# EAGLE design SparkyJr_v4FTDI (EAGLE 5.10)
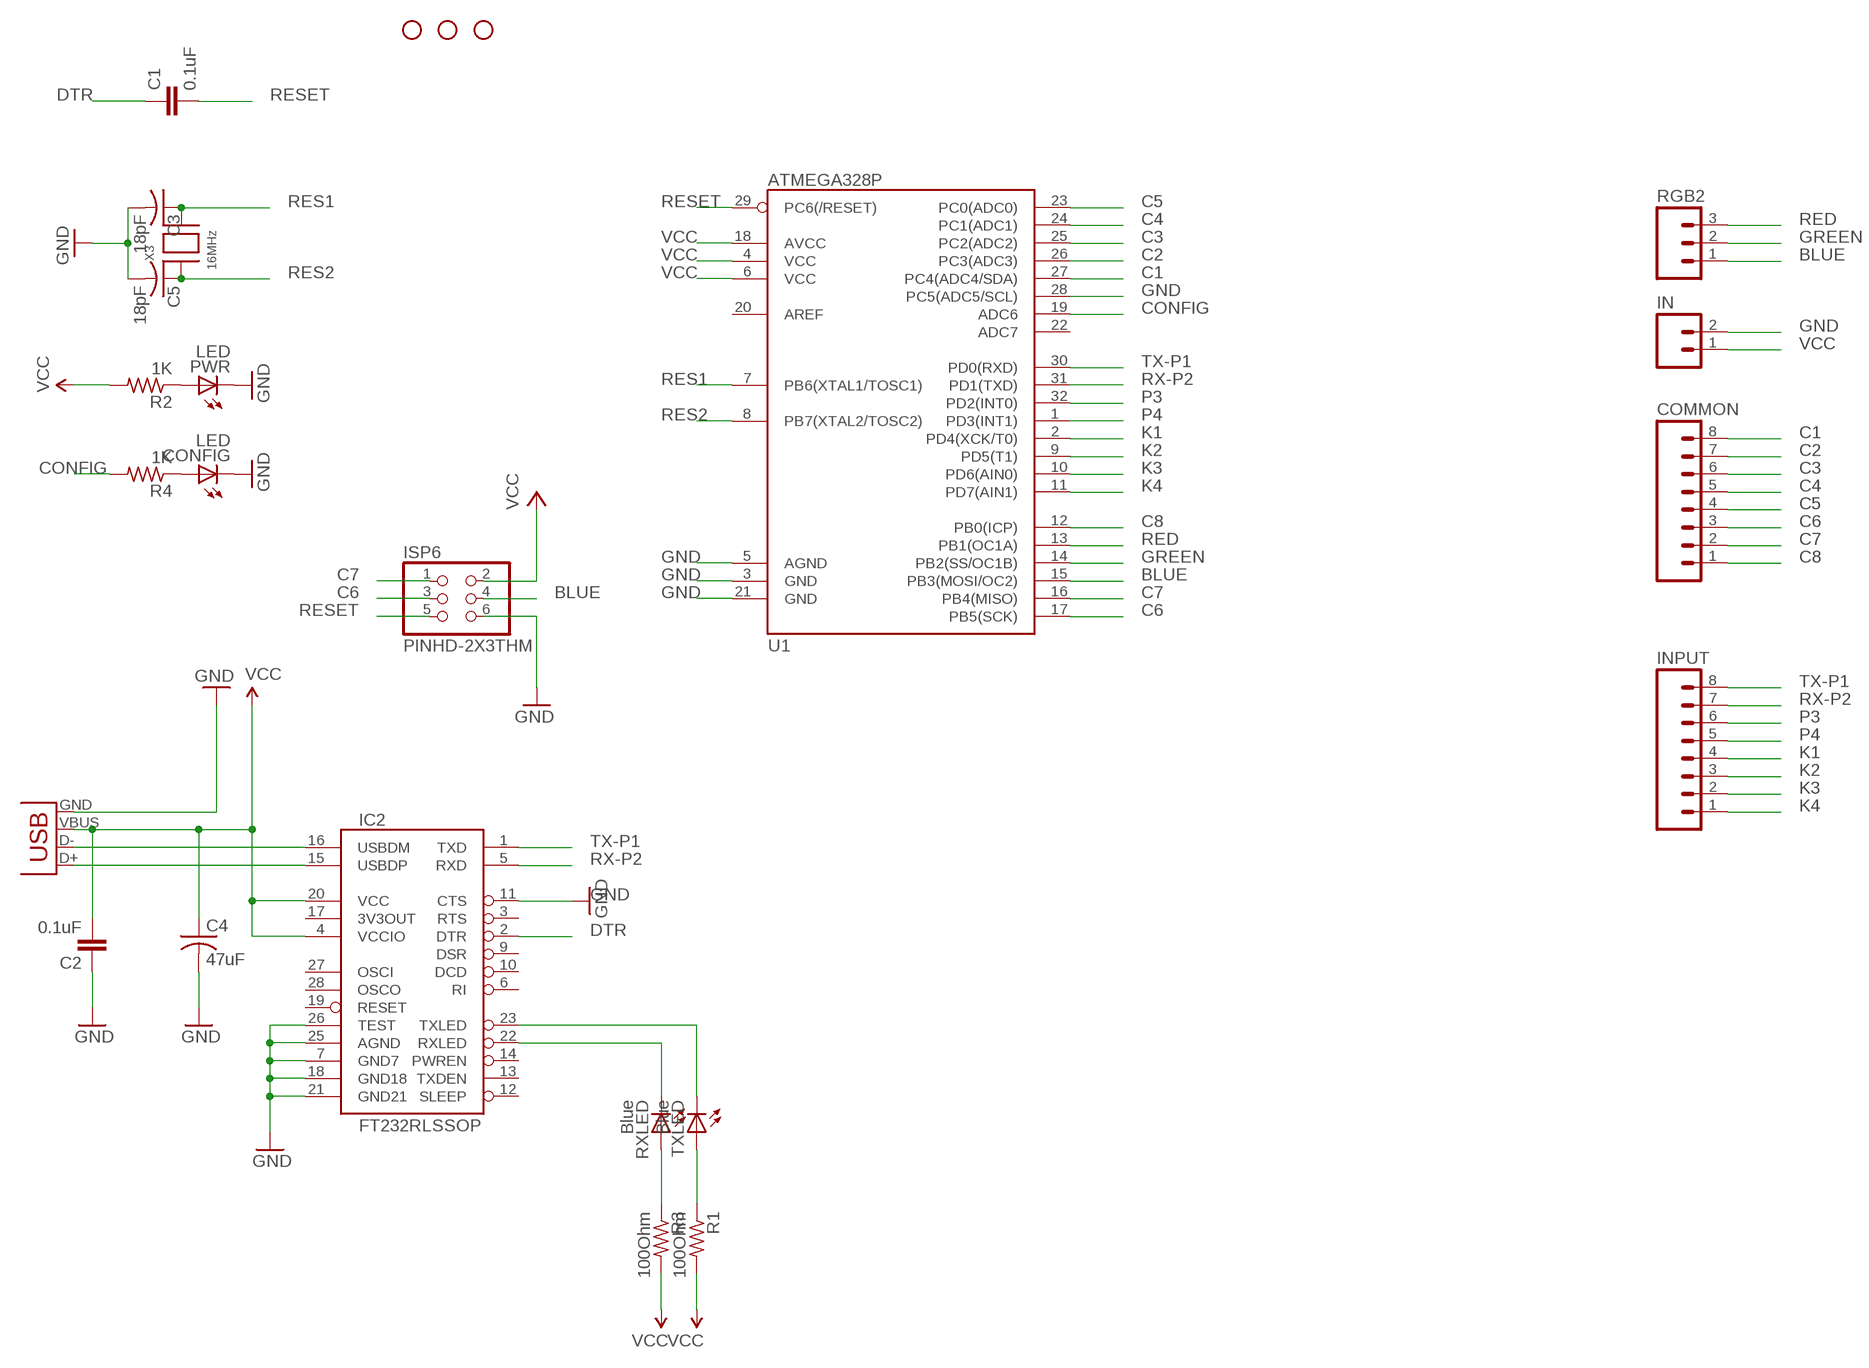
[diagram p0: schematic, sheet 1]

## Parts
C1  0.1uF  CAP0805  [0805]
C2  0.1uF  CAP0805  [0805]
C3  18pF  C-USC0805K  [C0805K]
C4  47uF  C-USC0805  [C0805]
C5  18pF  C-USC0805K  [C0805K]
COMMON  M08  [1X08]
CONFIG  LED  LEDCHIPLED_0805  [CHIPLED_0805]
IC2  FT232RLSSOP  [SSOP28DB]
IN  M02PTH  [1X02]
INPUT  M08  [1X08]
ISP6  PINHD-2X3THM  [ISP6]
JP1  STAND-OFF  [STAND-OFF]
JP2  STAND-OFF  [STAND-OFF]
JP3  STAND-OFF  [STAND-OFF]
PWR  LED  LEDCHIPLED_0805  [CHIPLED_0805]
R1  100Ohm  R-US_R0805  [R0805]
R2  1K  R-US_R0805  [R0805]
R3  100Ohm  R-US_R0805  [R0805]
R4  1K  R-US_R0805  [R0805]
RGB2  M03PTH  [1X03]
RXLED  Blue  LEDCHIPLED_0805  [CHIPLED_0805]
TXLED  Blue  LEDCHIPLED_0805  [CHIPLED_0805]
U1  ATMEGA328P  ATMEGA168  [TQFP32-08]
X1  USBPTH  [USB-B-PTH]
X3  16MHz  XTALNX5032  [NX5032]

## Nets
BLUE: ISP6.4 RGB2.1 U1.15(PB3(MOSI/OC2))
C1: COMMON.8 U1.27(PC4(ADC4/SDA))
C2: COMMON.7 U1.26(PC3(ADC3))
C3: COMMON.6 U1.25(PC2(ADC2))
C4: COMMON.5 U1.24(PC1(ADC1))
C5: COMMON.4 U1.23(PC0(ADC0))
C6: COMMON.3 ISP6.3 U1.17(PB5(SCK))
C7: COMMON.2 ISP6.1 U1.16(PB4(MISO))
C8: COMMON.1 U1.12(PB0(ICP))
CONFIG: R4.2 U1.19(ADC6)
D+: IC2.15(USBDP) X1.D+
D-: IC2.16(USBDM) X1.D-
DTR: C1.1 IC2.2(DTR)
GND: C2.1 C3.2 C4.2 C5.2 CONFIG.C IC2.7(GND7) IC2.11(CTS) IC2.18(GND18) IC2.21(GND21) IC2.25(AGND) IC2.26(TEST) IN.2 ISP6.6 PWR.C U1.3(GND) U1.5(AGND) U1.21(GND) U1.28(PC5(ADC5/SCL)) X1.GND
GREEN: RGB2.2 U1.14(PB2(SS/OC1B))
K1: INPUT.4 U1.2(PD4(XCK/T0))
K2: INPUT.3 U1.9(PD5(T1))
K3: INPUT.2 U1.10(PD6(AIN0))
K4: INPUT.1 U1.11(PD7(AIN1))
N$1: PWR.A R2.1
N$4: CONFIG.A R4.1
N$10: R3.1 RXLED.A
N$11: R1.1 TXLED.A
P3: INPUT.6 U1.32(PD2(INT0))
P4: INPUT.5 U1.1(PD3(INT1))
RED: RGB2.3 U1.13(PB1(OC1A))
RES1: C3.1 U1.7(PB6(XTAL1/TOSC1)) X3.P$2
RES2: C5.1 U1.8(PB7(XTAL2/TOSC2)) X3.P$1
RESET: C1.2 ISP6.5 U1.29(PC6(/RESET))
RX: IC2.22(RXLED) RXLED.C
RX-P2: IC2.5(RXD) INPUT.7 U1.31(PD1(TXD))
TX: IC2.23(TXLED) TXLED.C
TX-P1: IC2.1(TXD) INPUT.8 U1.30(PD0(RXD))
VCC: C2.2 C4.1 IC2.4(VCCIO) IC2.20(VCC) IN.1 ISP6.2 R1.2 R2.2 R3.2 U1.4(VCC) U1.6(VCC) U1.18(AVCC) X1.VBUS
Unconnected: IC2.3(RTS) IC2.6(RI) IC2.9(DSR) IC2.10(DCD) IC2.12(SLEEP) IC2.13(TXDEN) IC2.14(PWREN) IC2.17(3V3OUT) IC2.19(RESET) IC2.27(OSCI) IC2.28(OSCO) U1.20(AREF) U1.22(ADC7)

## Library data of the parts
C1 C2 = SparkFun:CAP: Capacitor Standard 0603 ceramic capacitor, and 0.1" leaded capacitor.
C3 C5 = adafruit:C-US: CAPACITOR, American symbol
C4 = rcl:C-US: CAPACITOR, American symbol
COMMON INPUT = SparkFun:M08: Header 8 Standard 8-pin 0.1" header. Use with straight break away headers (SKU : PRT-00116), right angle break away headers (PRT-00553), swiss pins (PRT-00743), machine pins (PRT-00117), and female headers (PRT-00115).
CONFIG PWR = adafruit:LED: LED
IC2 = SparkFun:FT232RL: USB UART FT232RL 4th Generation USB UART (USB <-> Serial) Controller. Spark Fun Electronics SKU : COM-00650
IN = SparkFun:M02: Header 2 Standard 2-pin 0.1" header. Use with straight break away headers (SKU : PRT-00116), right angle break away headers (PRT-00553), swiss pins (PRT-00743), machine pins (PRT-00117), and female headers (PRT-00115). Molex polarized connector foot print use with SKU : PRT-08233 with associated crimp pins and housings.
ISP6 = adaprog:PINHD-2X3
JP1-JP3 = SparkFun:STAND-OFF: Stand Off This is the mechanical footprint for a #4 phillips button head screw. Use the keepout ring to avoid running the screw head into surrounding components. SKU : PRT-00447
R1-R4 = adafruit:R-US_: RESISTOR, American symbol
RGB2 = SparkFun:M03: Header 3 Standard 3-pin 0.1" header. Use with straight break away headers (SKU : PRT-00116), right angle break away headers (PRT-00553), swiss pins (PRT-00743), machine pins (PRT-00117), and female headers (PRT-00115). Molex polarized connector foot print use with SKU : PRT-08232 with associated crimp pins and housings.
RXLED TXLED = led:LED: LED
U1 = SparkFun:ATMEGA168
X1 = SparkFun:USB: USB Connectors USB-B-PTH is fully proven SKU : PRT-00139 USB-miniB is fully proven SKU : PRT-00587 USB-A-PCB is untested. USB-A-H is throughly reviewed, but untested. Spark Fun Electronics SKU : PRT-00437 USB-B-SMT is throughly reviewed, but untested. Needs silkscreen touching up. USB-A-S has not been used/tested USB-MB-H has not been used/tested
X3 = adaprog:XTAL

## Board
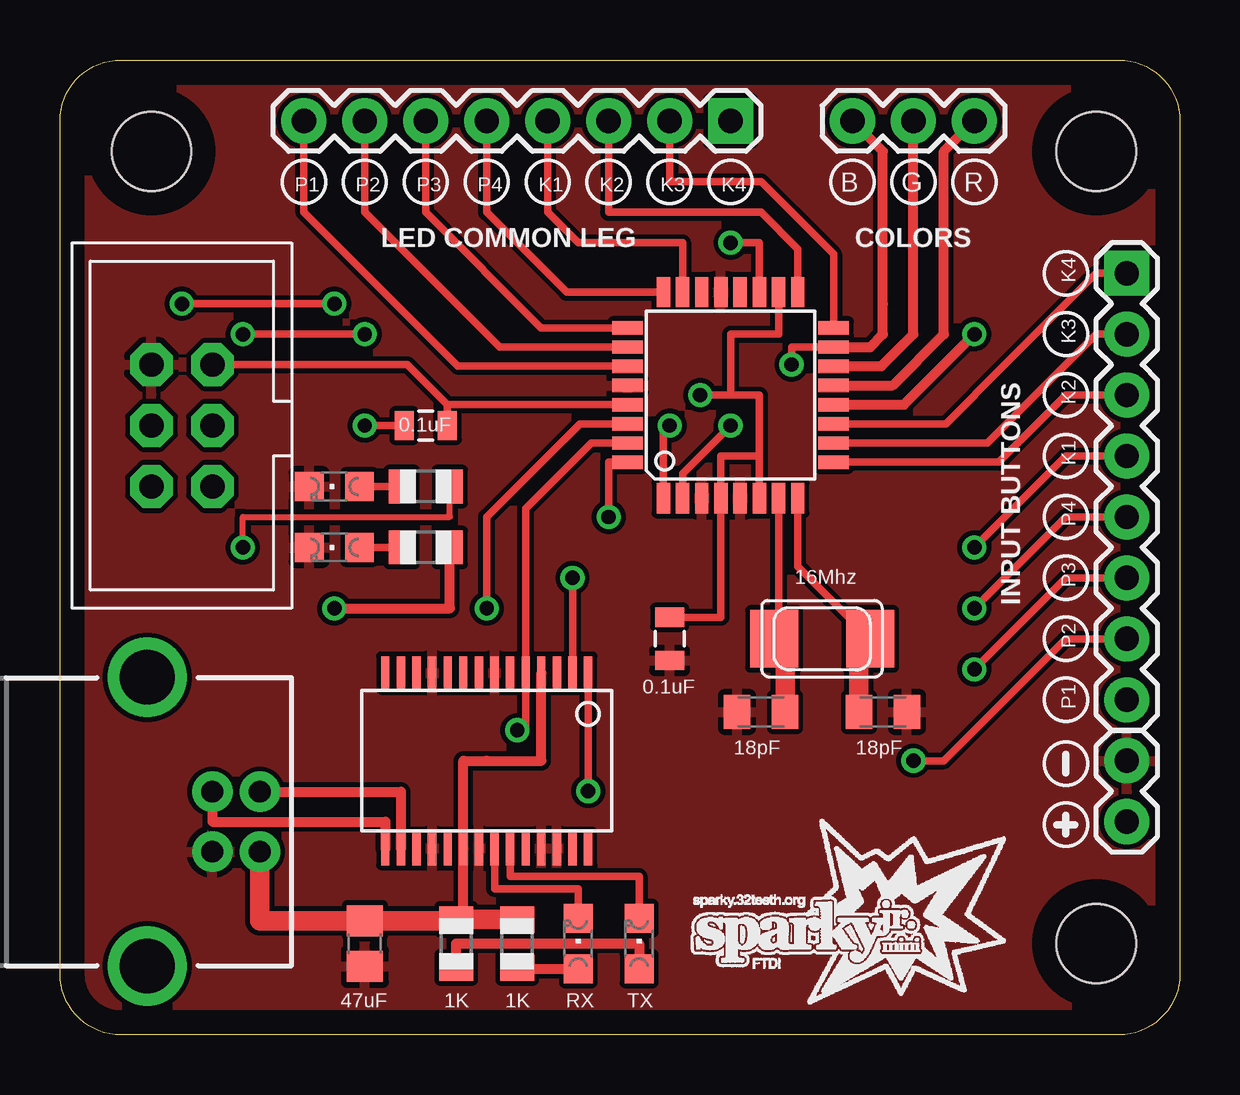
[diagram p1: board, top side]
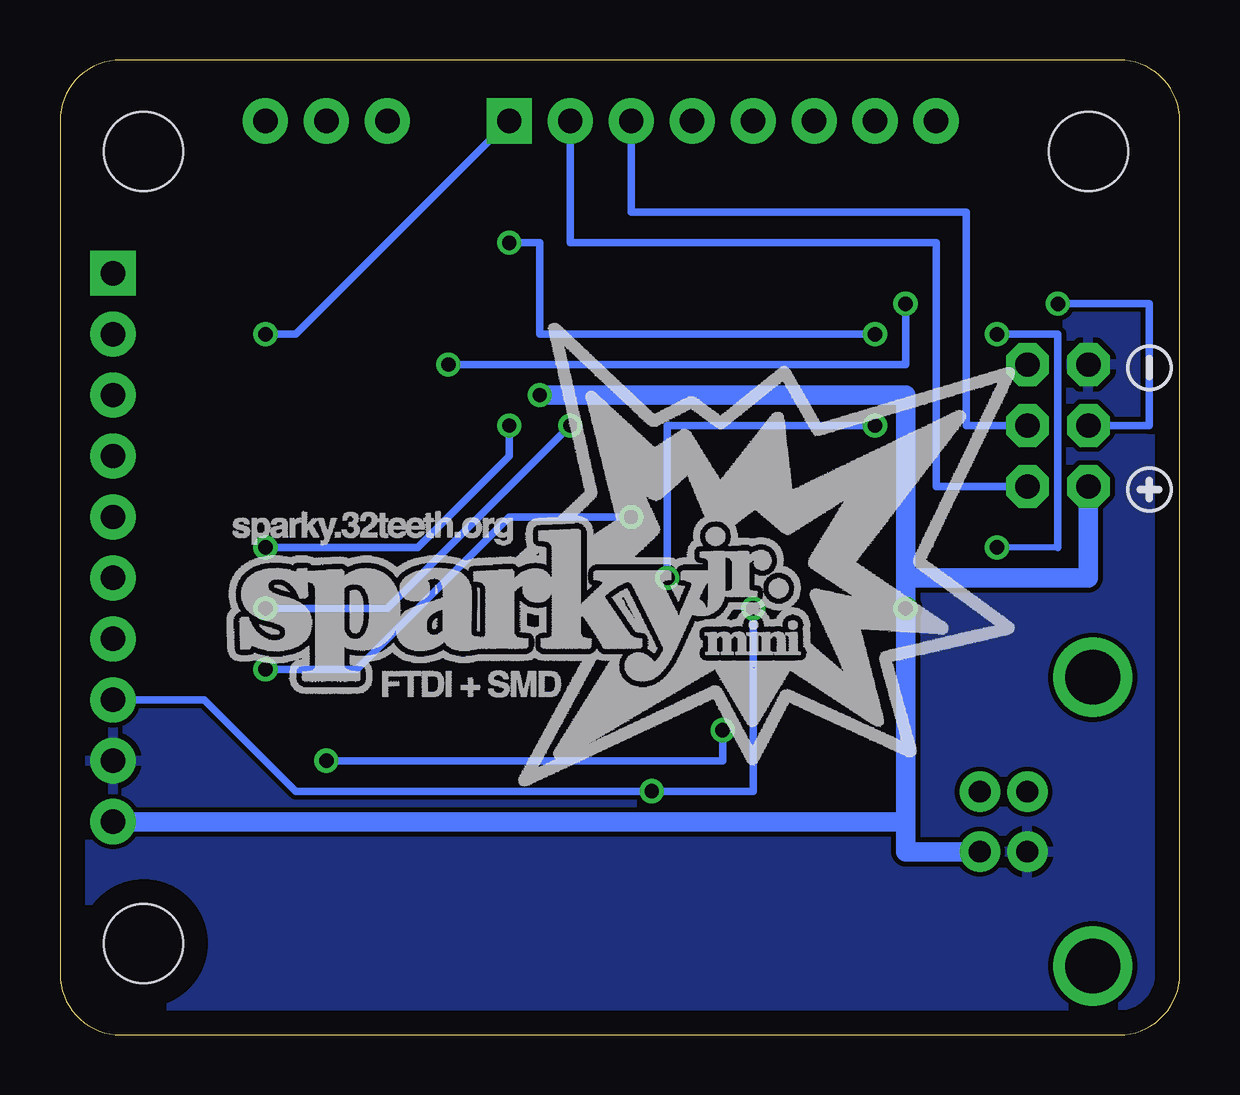
[diagram p2: board, bottom side, seen from below]

Size 46.66 x 40.64 mm. Coordinates in mm from the lower left corner, seen from the top.
Outline: 44.12,0 arc90 46.66,2.54 46.66,38.1 arc90 44.12,40.64 2.54,40.64 arc90 0,38.1 0,2.54 arc90 2.54,0
Outline: 44.12,0 2.54,0
Outline: 44.12,0 2.54,0
Copper layers (1*16): Top 0.035mm / dielectric 1.5mm / Bottom 0.035mm
Design rules "default": minimum track width 10mil, minimum drill 24mil, track to track 8mil, track to pad 8mil, pad to pad 8mil, via to via 8mil, smd to smd 8mil, copper to edge 40mil, drill to drill 8mil, minimum pad ring 10mil, minimum via ring 8mil, stop-mask expansion 4mil, vias tented up to drill 0mil, thermal gap 10mil

### Footprints (pad centres in the part's own frame; a part is rotated, then mirrored left to right if it is on the bottom)
0805 = smd 0.8 x 1.2: 1 -0.9,0; 2 0.9,0
C0805K = smd 1.1 x 1.4: 1 -1,0; 2 1,0
C0805 = smd 1.3 x 1.5: 1 -0.95,0; 2 0.95,0
1X08 = drill 1.016 pad 1.88 square: 1 0,0 | drill 1.016 pad 1.88: 2 2.54,0; 3 5.08,0; 4 7.62,0; 5 10.16,0; 6 12.7,0; 7 15.24,0; 8 17.78,0
CHIPLED_0805 = smd 1.2 x 1.2: A 0,-1.05; C 0,1.05
SSOP28DB = smd 0.348 x 1.397: 1 -4.225,-3.656; 2 -3.575,-3.656; 3 -2.925,-3.656; 4 -2.275,-3.656; 5 -1.625,-3.656; 6 -0.975,-3.656; 7 -0.325,-3.656; 8 0.325,-3.656; 9 0.975,-3.656; 10 1.625,-3.656; 11 2.275,-3.656; 12 2.925,-3.656; 13 3.575,-3.656; 14 4.225,-3.656; 15 4.225,3.656; 16 3.575,3.656; 17 2.925,3.656; 18 2.275,3.656; 19 1.625,3.656; 20 0.975,3.656; 21 0.325,3.656; 22 -0.325,3.656; 23 -0.975,3.656; 24 -1.625,3.656; 25 -2.275,3.656; 26 -2.925,3.656; 27 -3.575,3.656; 28 -4.225,3.656
1X02 = drill 1.016 pad 1.88: 1 0,0; 2 2.54,0
ISP6 = drill 1.016 pad 1.778 octagon: 1 -2.54,-1.27; 2 -2.54,1.27; 3 0,-1.27; 4 0,1.27; 5 2.54,-1.27; 6 2.54,1.27
STAND-OFF = hole 3.302: 0,0
R0805 = smd 1.1 x 1.4: 1 -1,0; 2 1,0
1X03 = drill 1.016 pad 1.88: 1 0,0; 2 2.54,0; 3 5.08,0
TQFP32-08 = smd 1.27 x 0.559: 1 -4.293,2.8; 2 -4.293,2; 3 -4.293,1.2; 4 -4.293,0.4; 5 -4.293,-0.4; 6 -4.293,-1.2; 7 -4.293,-2; 8 -4.293,-2.8; 17 4.293,-2.8; 18 4.293,-2; 19 4.293,-1.2; 20 4.293,-0.4; 21 4.293,0.4; 22 4.293,1.2; 23 4.293,2; 24 4.293,2.8 | smd 0.559 x 1.27: 9 -2.8,-4.293; 10 -2,-4.293; 11 -1.2,-4.293; 12 -0.4,-4.293; 13 0.4,-4.293; 14 1.2,-4.293; 15 2,-4.293; 16 2.8,-4.293; 25 2.8,4.293; 26 2,4.293; 27 1.2,4.293; 28 0.4,4.293; 29 -0.4,4.293; 30 -1.2,4.293; 31 -2,4.293; 32 -2.8,4.293
USB-B-PTH = drill 0.914 pad 1.676: D+ 0,1.25; D- 1.981,1.25; GND 0,-1.25; VBUS 1.981,-1.25 | drill 2.286: P$1 -2.718,-6.02; P$2 -2.718,6.02
NX5032 = smd 2 x 2.4: P$1 2,0; P$2 -2,0

### Placement (x,y rotation side)
C1  15.24,25.4 0 top
C2  25.4,16.51 90 top
C3  29.21,13.46 180 top
C4  12.7,3.81 270 top
C5  34.29,13.46 0 top
COMMON  27.94,38.1 180 top
CONFIG  11.43,22.86 90 top
IC2  17.78,11.43 180 top
IN  44.45,8.89 90 top
INPUT  44.45,31.75 270 top
ISP6  5.08,25.4 90 top
JP1  3.81,36.83 0 top
JP2  43.18,36.83 0 top
JP3  43.18,3.81 0 top
PWR  11.43,20.32 90 top
R1  16.51,3.81 90 top
R2  15.24,20.32 0 top
R3  19.05,3.81 90 top
R4  15.24,22.86 0 top
RGB2  33.02,38.1 0 top
RXLED  21.59,3.81 0 top
TXLED  24.13,3.81 0 top
U1  27.94,26.67 90 top
X1  6.35,8.89 0 top
X3  31.75,16.51 0 top

### Tracks (layer width: path | path; a pad name or v marks a point on that pad's centre or on a via)
BLUE  (via drill 0.6)
  Top 0.305: U1.15 30.48,28.67 v30.48,27.94 | v5.08,30.48 v11.43,30.48
  Top 0.406: RGB2.1 34.29,36.83 34.29,30.48 34.29,29.21 33.75,28.67 U1.15
  Bottom 0.305: v30.48,27.94 11.43,27.94 v11.43,30.48 | v5.08,30.48 1.27,30.48 1.27,25.4 ISP6.4
C1
  Top 0.305: COMMON.8 10.16,34.29 16.58,27.87 U1.27
C2
  Top 0.305: COMMON.7 12.7,34.29 18.32,28.67 U1.26
C3
  Top 0.305: COMMON.6 15.24,34.29 20.06,29.47 U1.25
C4
  Top 0.305: COMMON.5 17.78,34.29 21.11,30.96 U1.24
C5
  Top 0.305: COMMON.4 20.32,34.29 21.59,33.02 25.94,33.02 U1.23
C6
  Top 0.305: COMMON.3 22.86,34.29 29.21,34.29 30.74,32.76 U1.17
  Bottom 0.305: COMMON.3 22.86,34.29 8.89,34.29 8.89,25.4 ISP6.3
C7
  Top 0.305: U1.16 32.23,32.54 29.21,35.56 25.4,35.56 COMMON.2
  Bottom 0.305: COMMON.2 25.4,33.02 10.16,33.02 10.16,22.86 ISP6.1
C8  (via drill 0.6)
  Top 0.406: U1.12 35.16,26.27 v38.1,29.21
  Bottom 0.305: v38.1,29.21 36.83,29.21 COMMON.1
CONFIG  (via drill 0.6)
  Top 0.254: v7.62,20.32 7.62,21.59 16.24,21.59 R4.2
  Top 0.305: U1.19 29.14,33.02 v27.94,33.02 | v7.62,29.21 v12.7,29.21
  Bottom 0.254: 5.08,20.32 v7.62,20.32
  Bottom 0.305: v27.94,33.02 26.67,33.02 26.67,29.21 v12.7,29.21 | v7.62,29.21 5.08,29.21 5.08,20.32
D+
  Top 0.406: X1.D+ 6.35,8.89 13.55,8.89 IC2.15
D-
  Top 0.406: X1.D- 14.21,10.14 IC2.16
DTR  (via drill 0.6)
  Top 0.305: IC2.2 v21.36,19.05 | v12.7,25.4 C1.1
  Bottom 0.305: v12.7,25.4 21.36,25.4 v21.36,19.05
GND
  pour Top: 0,40.64 46.99,40.64 46.99,0 0,0
  pour Bottom: 0,40.64 46.99,40.64 46.99,0 0,0
GREEN
  Top 0.406: RGB2.2 35.56,29.21 34.22,27.87 U1.14
K1  (via drill 0.6)
  Top 0.305: INPUT.4 41.91,24.13 v38.1,20.32 | v27.94,25.4 25.94,23.4 U1.2
  Bottom 0.305: v38.1,20.32 31.75,20.32 27.94,24.13 v27.94,25.4
K2
  Top 0.305: INPUT.3 41.91,26.67 39.37,24.13 39.11,23.87 U1.9
K3
  Top 0.305: INPUT.2 43.18,29.21 39.37,25.4 38.64,24.67 U1.10
K4
  Top 0.305: INPUT.1 43.18,31.75 39.37,27.94 36.9,25.47 U1.11
N$1
  Top 0.305: PWR.A R2.1
N$4
  Top 0.305: CONFIG.A R4.1
N$10
  Top 0.406: RXLED.A 19.05,2.76 R3.1
N$11
  Top 0.406: R1.1 16.51,3.81 24.13,3.81 TXLED.A
P3  (via drill 0.6)
  Top 0.305: INPUT.6 41.91,19.05 v38.1,15.24 | v22.86,21.59 22.86,23.87 U1.32
  Bottom 0.305: v38.1,15.24 34.29,15.24 27.94,21.59 v22.86,21.59
P4  (via drill 0.6)
  Top 0.305: INPUT.5 41.91,21.59 v38.1,17.78 | v25.4,25.4 25.14,25.14 U1.1
  Bottom 0.305: v38.1,17.78 33.02,17.78 v25.4,25.4
RED
  Top 0.406: RGB2.3 36.83,36.83 36.83,29.21 34.69,27.07 U1.13
RES1
  Top 0.305: U1.7 29.94,16.51 X3.P$2
  Top 0.813: X3.P$2 30.21,16.05 C3.1
RES2
  Top 0.305: U1.8 30.74,19.52 X3.P$1
  Top 0.813: C5.1 33.29,16.51 X3.P$1
RESET
  Top 0.305: ISP6.5 13.07,27.94 13.6,27.94 14.47,27.94 16.14,26.27 | 16.14,26.27 C1.2 | 16.14,26.27 U1.29
RX
  Top 0.305: RXLED.C 21.59,6.1 18.11,6.1 IC2.22
RX-P2  (via drill 0.6)
  Top 0.305: U1.31 22.13,24.67 20.32,22.86 19.41,21.95 IC2.5 19.41,12.7 v19.05,12.7 | INPUT.7 41.91,16.51 36.83,11.43 v35.56,11.43
  Bottom 0.305: v35.56,11.43 19.05,11.43 v19.05,12.7
TX
  Top 0.305: TXLED.C 24.13,6.6 18.75,6.6 IC2.23
TX-P1  (via drill 0.6)
  Top 0.305: U1.30 21.66,25.47 17.78,21.59 v17.78,17.78 | v22,10.16 IC2.1
  Bottom 0.305: v17.78,17.78 17.78,10.16 v22,10.16 36.83,10.16 40.64,13.97 INPUT.8
VCC  (via drill 0.6)
  Top 0.305: v26.67,26.67 27.94,26.67 | 27.94,26.67 29.14,26.67 29.14,24.13 | 29.14,24.13 U1.6 | U1.18 29.94,29.21 27.94,29.21 27.94,26.67 | 29.14,24.13 27.54,24.13 U1.4 27.54,17.41 C2.2 | R1.2 16.8,4.81
  Top 0.406: IC2.4 20.05,11.43 17.78,11.43 16.8,11.43 IC2.20 16.8,4.81 R1.2 | R2.2 16.24,17.78 v11.43,17.78
  Top 0.813: X1.VBUS 8.33,4.76 C4.1 16.51,4.76 R1.2 R3.2
  Bottom 0.406: 11.43,16.51 v11.43,17.78
  Bottom 0.813: X1.VBUS 11.43,7.64 11.43,8.89 | 11.43,8.89 11.43,16.51 v11.43,17.78 11.43,19.05 | 11.43,19.05 11.43,26.67 v26.67,26.67 | ISP6.2 3.81,19.05 11.43,19.05 | 11.43,8.89 IN.1

### Text on the board
tPlace: B | G | R | P1 | P2 | P3 | P4 | K1 | K2 | K3 | K4 | LED COMMON LEG | COLORS | K4 | K3 | K2 | 0.1uF | K1 | P4 | 16Mhz | P3 | INPUT BUTTONS | P2 | 0.1uF | P1 | 18pF | 18pF | 47uF | 1K | 1K | RX | TX